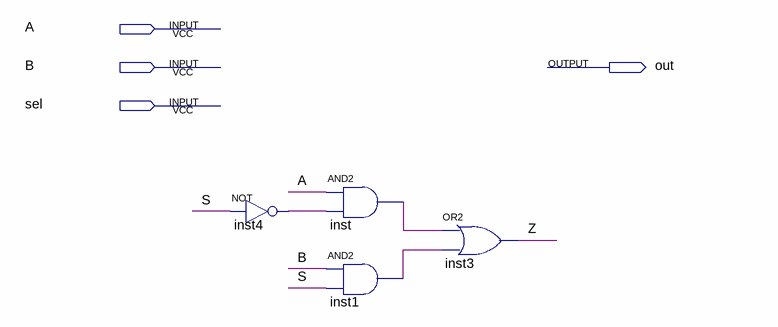
[diagram p0: schematic sheet]
// Quartus schematic MUX_2x1_1bit.bdf as structural Verilog: 4 symbols, 4 pins
module MUX_2x1_1bit (
  input  A,
  input  B,
  input  sel,
  output out
);

  wire inst1_out, inst4_out, inst_out, S, Z;

  not inst4 (inst4_out, S);
  and inst (inst_out, A, inst4_out);
  and inst1 (inst1_out, B, S);
  or inst3 (Z, inst_out, inst1_out);
endmodule
